# Altium schematic sheet 04_Zynq_Power.SchDoc
size A2; SheetNumber: 5; SheetTotal: 7
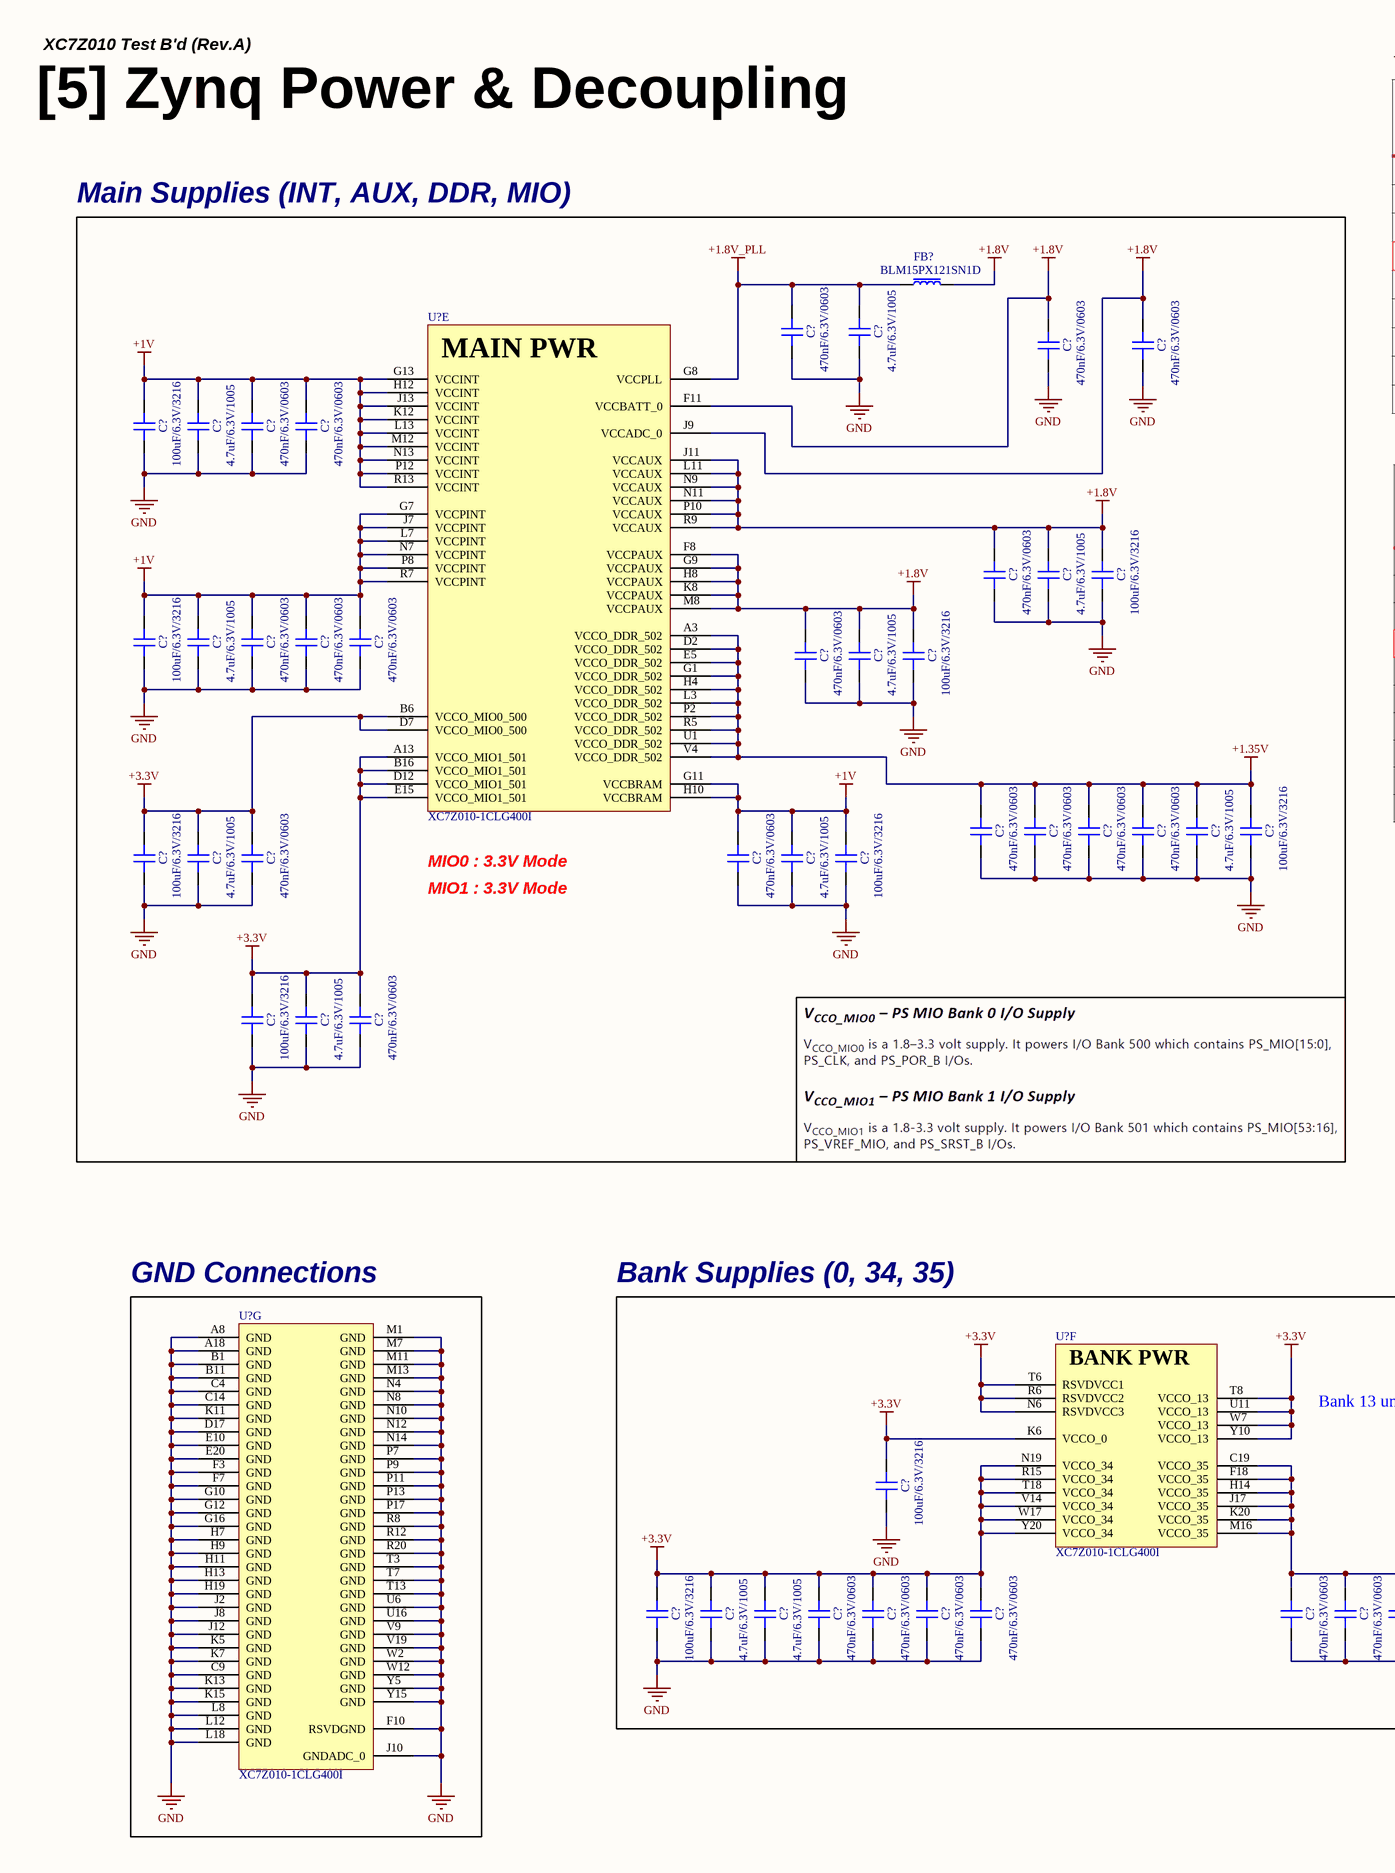
[diagram p0: 04_Zynq_Power.SchDoc, left]
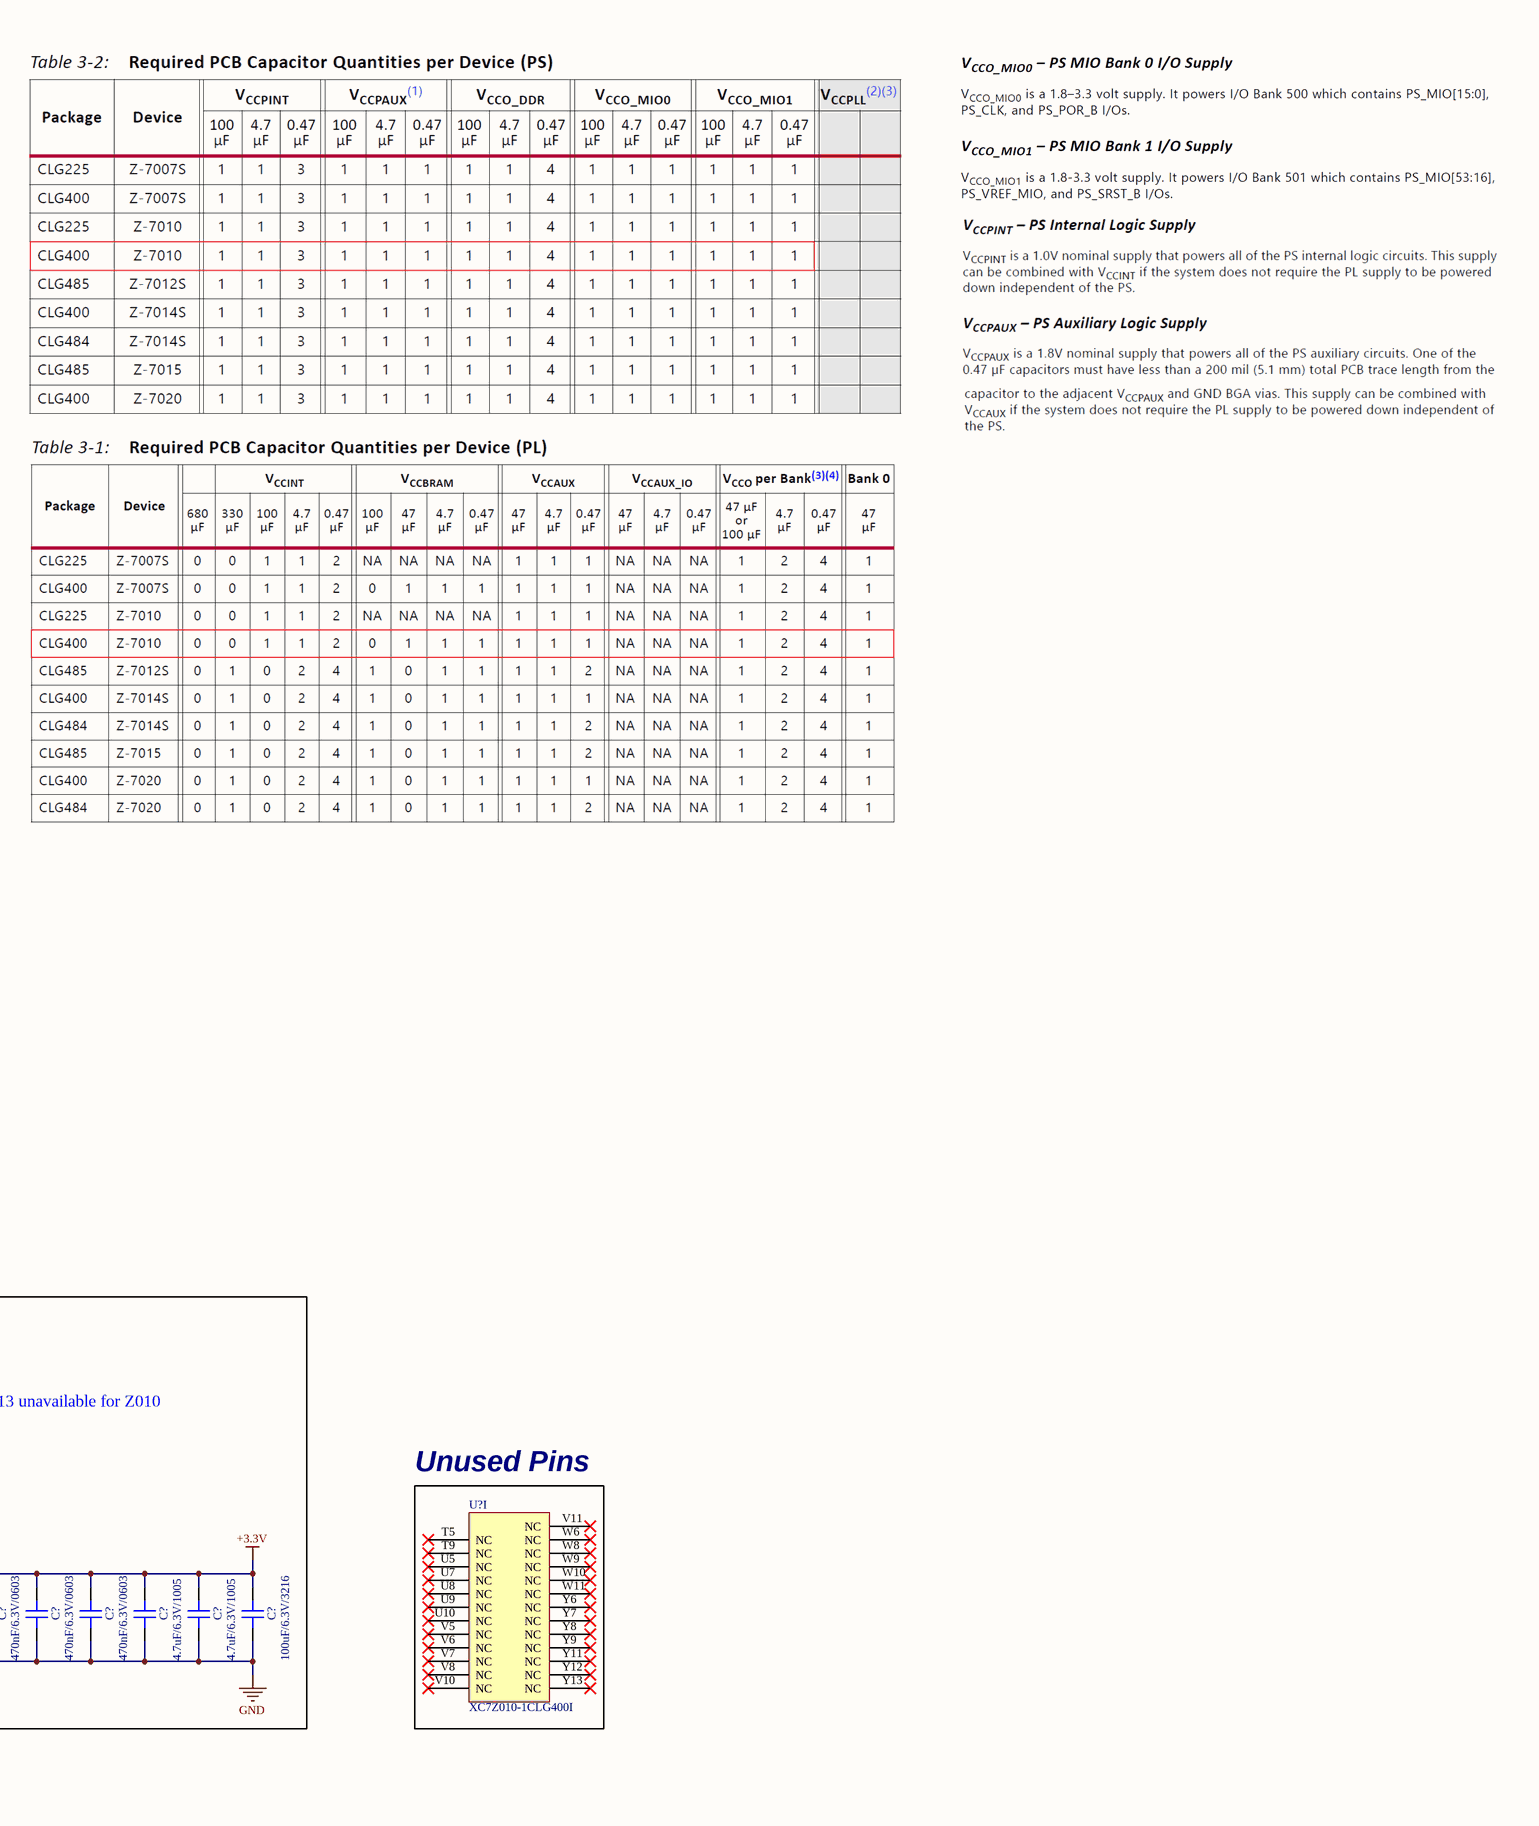
[diagram p1: 04_Zynq_Power.SchDoc, right]

## Parts
(Parts that share a designator on the sheet are numbered #1, #2 ... from top to bottom, then left to right.)
C?#1  470nF/6.3V/0603  [CAP 0603 (0201_INCH)]
C?#2  4.7uF/6.3V/1005  [CAP 1005 (0402_INCH)]
C?#3  470nF/6.3V/0603  [CAP 0603 (0201_INCH)]
C?#4  470nF/6.3V/0603  [CAP 0603 (0201_INCH)]
C?#5  100uF/6.3V/3216  [CAP 3216 (1206_INCH) - H1.8MM]
C?#6  4.7uF/6.3V/1005  [CAP 1005 (0402_INCH)]
C?#7  470nF/6.3V/0603  [CAP 0603 (0201_INCH)]
C?#8  470nF/6.3V/0603  [CAP 0603 (0201_INCH)]
C?#9  470nF/6.3V/0603  [CAP 0603 (0201_INCH)]
C?#10  4.7uF/6.3V/1005  [CAP 1005 (0402_INCH)]
C?#11  100uF/6.3V/3216  [CAP 3216 (1206_INCH) - H1.8MM]
C?#12  100uF/6.3V/3216  [CAP 3216 (1206_INCH) - H1.8MM]
C?#13  4.7uF/6.3V/1005  [CAP 1005 (0402_INCH)]
C?#14  470nF/6.3V/0603  [CAP 0603 (0201_INCH)]
C?#15  470nF/6.3V/0603  [CAP 0603 (0201_INCH)]
C?#16  470nF/6.3V/0603  [CAP 0603 (0201_INCH)]
C?#17  470nF/6.3V/0603  [CAP 0603 (0201_INCH)]
C?#18  4.7uF/6.3V/1005  [CAP 1005 (0402_INCH)]
C?#19  100uF/6.3V/3216  [CAP 3216 (1206_INCH) - H1.8MM]
C?#20  470nF/6.3V/0603  [CAP 0603 (0201_INCH)]
C?#21  470nF/6.3V/0603  [CAP 0603 (0201_INCH)]
C?#22  470nF/6.3V/0603  [CAP 0603 (0201_INCH)]
C?#23  470nF/6.3V/0603  [CAP 0603 (0201_INCH)]
C?#24  4.7uF/6.3V/1005  [CAP 1005 (0402_INCH)]
C?#25  100uF/6.3V/3216  [CAP 3216 (1206_INCH) - H1.8MM]
C?#26  100uF/6.3V/3216  [CAP 3216 (1206_INCH) - H1.8MM]
C?#27  4.7uF/6.3V/1005  [CAP 1005 (0402_INCH)]
C?#28  470nF/6.3V/0603  [CAP 0603 (0201_INCH)]
C?#29  470nF/6.3V/0603  [CAP 0603 (0201_INCH)]
C?#30  4.7uF/6.3V/1005  [CAP 1005 (0402_INCH)]
C?#31  100uF/6.3V/3216  [CAP 3216 (1206_INCH) - H1.8MM]
C?#32  100uF/6.3V/3216  [CAP 3216 (1206_INCH) - H1.8MM]
C?#33  4.7uF/6.3V/1005  [CAP 1005 (0402_INCH)]
C?#34  470nF/6.3V/0603  [CAP 0603 (0201_INCH)]
C?#35  100uF/6.3V/3216  [CAP 3216 (1206_INCH) - H1.8MM]
C?#36  100uF/6.3V/3216  [CAP 3216 (1206_INCH) - H1.8MM]
C?#37  4.7uF/6.3V/1005  [CAP 1005 (0402_INCH)]
C?#38  4.7uF/6.3V/1005  [CAP 1005 (0402_INCH)]
C?#39  470nF/6.3V/0603  [CAP 0603 (0201_INCH)]
C?#40  470nF/6.3V/0603  [CAP 0603 (0201_INCH)]
C?#41  470nF/6.3V/0603  [CAP 0603 (0201_INCH)]
C?#42  470nF/6.3V/0603  [CAP 0603 (0201_INCH)]
C?#43  470nF/6.3V/0603  [CAP 0603 (0201_INCH)]
C?#44  470nF/6.3V/0603  [CAP 0603 (0201_INCH)]
C?#45  470nF/6.3V/0603  [CAP 0603 (0201_INCH)]
C?#46  470nF/6.3V/0603  [CAP 0603 (0201_INCH)]
C?#47  4.7uF/6.3V/1005  [CAP 1005 (0402_INCH)]
C?#48  4.7uF/6.3V/1005  [CAP 1005 (0402_INCH)]
C?#49  100uF/6.3V/3216  [CAP 3216 (1206_INCH) - H1.8MM]
FB?  BLM15PX121SN1D  [FB 1005 (0402_inch)]
U?#1  XC7Z010-1CLG400I  (part E of 9)
U?#2  XC7Z010-1CLG400I  (part G of 9)
U?#3  XC7Z010-1CLG400I  (part F of 9)
U?#4  XC7Z010-1CLG400I  (part I of 9)

## Blocks framed on the sheet
Main Supplies (INT, AUX, DDR, MIO): C?#1-C?#34 FB? U?#1
GND Connections: U?#2
Bank Supplies (0, 34, 35): C?#35-C?#49 U?#3
Unused Pins: U?#4

## Nets
+1.8V: C?#3.2 C?#4.2 C?#9.2 C?#10.2 C?#11.2 C?#17.2 C?#18.2 C?#19.2 FB?.2 U?#1.F8(VCCPAUX) U?#1.F11(VCCBATT_0) U?#1.G9(VCCPAUX) U?#1.H8(VCCPAUX) U?#1.J9(VCCADC_0) U?#1.J11(VCCAUX) U?#1.K8(VCCPAUX) U?#1.L11(VCCAUX) U?#1.M8(VCCPAUX) U?#1.N9(VCCAUX) U?#1.N11(VCCAUX) U?#1.P10(VCCAUX) U?#1.R9(VCCAUX)
+1.8V_PLL: C?#1.2 C?#2.2 FB?.1 U?#1.G8(VCCPLL)
+1.35V: C?#20.2 C?#21.2 C?#22.2 C?#23.2 C?#24.2 C?#25.2 U?#1.A3(VCCO_DDR_502) U?#1.D2(VCCO_DDR_502) U?#1.E5(VCCO_DDR_502) U?#1.G1(VCCO_DDR_502) U?#1.H4(VCCO_DDR_502) U?#1.L3(VCCO_DDR_502) U?#1.P2(VCCO_DDR_502) U?#1.R5(VCCO_DDR_502) U?#1.U1(VCCO_DDR_502) U?#1.V4(VCCO_DDR_502)
+1V: C?#5.2 C?#6.2 C?#7.2 C?#8.2 C?#12.2 C?#13.2 C?#14.2 C?#15.2 C?#16.2 C?#29.2 C?#30.2 C?#31.2 U?#1.G7(VCCPINT) U?#1.G11(VCCBRAM) U?#1.G13(VCCINT) U?#1.H10(VCCBRAM) U?#1.H12(VCCINT) U?#1.J7(VCCPINT) U?#1.J13(VCCINT) U?#1.K12(VCCINT) U?#1.L7(VCCPINT) U?#1.L13(VCCINT) U?#1.M12(VCCINT) U?#1.N7(VCCPINT) U?#1.N13(VCCINT) U?#1.P8(VCCPINT) U?#1.P12(VCCINT) U?#1.R7(VCCPINT) U?#1.R13(VCCINT)
+3.3V: C?#26.2 C?#27.2 C?#28.2 C?#32.2 C?#33.2 C?#34.2 C?#35.2 C?#36.2 C?#37.2 C?#38.2 C?#39.2 C?#40.2 C?#41.2 C?#42.2 C?#43.2 C?#44.2 C?#45.2 C?#46.2 C?#47.2 C?#48.2 C?#49.2 U?#1.A13(VCCO_MIO1_501) U?#1.B6(VCCO_MIO0_500) U?#1.B16(VCCO_MIO1_501) U?#1.D7(VCCO_MIO0_500) U?#1.D12(VCCO_MIO1_501) U?#1.E15(VCCO_MIO1_501) U?#3.C19(VCCO_35) U?#3.F18(VCCO_35) U?#3.H14(VCCO_35) U?#3.J17(VCCO_35) U?#3.K6(VCCO_0) U?#3.K20(VCCO_35) U?#3.M16(VCCO_35) U?#3.N6(RSVDVCC3) U?#3.N19(VCCO_34) U?#3.R6(RSVDVCC2) U?#3.R15(VCCO_34) U?#3.T6(RSVDVCC1) U?#3.T8(VCCO_13) U?#3.T18(VCCO_34) U?#3.U11(VCCO_13) U?#3.V14(VCCO_34) U?#3.W7(VCCO_13) U?#3.W17(VCCO_34) U?#3.Y10(VCCO_13) U?#3.Y20(VCCO_34)
GND: C?#1.1 C?#2.1 C?#3.1 C?#4.1 C?#5.1 C?#6.1 C?#7.1 C?#8.1 C?#9.1 C?#10.1 C?#11.1 C?#12.1 C?#13.1 C?#14.1 C?#15.1 C?#16.1 C?#17.1 C?#18.1 C?#19.1 C?#20.1 C?#21.1 C?#22.1 C?#23.1 C?#24.1 C?#25.1 C?#26.1 C?#27.1 C?#28.1 C?#29.1 C?#30.1 C?#31.1 C?#32.1 C?#33.1 C?#34.1 C?#35.1 C?#36.1 C?#37.1 C?#38.1 C?#39.1 C?#40.1 C?#41.1 C?#42.1 C?#43.1 C?#44.1 C?#45.1 C?#46.1 C?#47.1 C?#48.1 C?#49.1 U?#2.A8(GND) U?#2.A18(GND) U?#2.B1(GND) U?#2.B11(GND) U?#2.C4(GND) U?#2.C9(GND) U?#2.C14(GND) U?#2.D17(GND) U?#2.E10(GND) U?#2.E20(GND) U?#2.F3(GND) U?#2.F7(GND) U?#2.F10(RSVDGND) U?#2.G10(GND) U?#2.G12(GND) U?#2.G16(GND) U?#2.H7(GND) U?#2.H9(GND) U?#2.H11(GND) U?#2.H13(GND) U?#2.H19(GND) U?#2.J2(GND) U?#2.J8(GND) U?#2.J10(GNDADC_0) U?#2.J12(GND) U?#2.K5(GND) U?#2.K7(GND) U?#2.K11(GND) U?#2.K13(GND) U?#2.K15(GND) U?#2.L8(GND) U?#2.L12(GND) U?#2.L18(GND) U?#2.M1(GND) U?#2.M7(GND) U?#2.M11(GND) U?#2.M13(GND) U?#2.N4(GND) U?#2.N8(GND) U?#2.N10(GND) U?#2.N12(GND) U?#2.N14(GND) U?#2.P7(GND) U?#2.P9(GND) U?#2.P11(GND) U?#2.P13(GND) U?#2.P17(GND) U?#2.R8(GND) U?#2.R12(GND) U?#2.R20(GND) U?#2.T3(GND) U?#2.T7(GND) U?#2.T13(GND) U?#2.U6(GND) U?#2.U16(GND) U?#2.V9(GND) U?#2.V19(GND) U?#2.W2(GND) U?#2.W12(GND) U?#2.Y5(GND) U?#2.Y15(GND)

Not connected (* = marked no-connect by the designer): U?#4 T5(NC)* T9(NC)* U5(NC)* U7(NC)* U8(NC)* U9(NC)* U10(NC)* V5(NC)* V6(NC)* V7(NC)* V8(NC)* V10(NC)* V11(NC)* W6(NC)* W8(NC)* W9(NC)* W10(NC)* W11(NC)* Y6(NC)* Y7(NC)* Y8(NC)* Y9(NC)* Y11(NC)* Y12(NC)* Y13(NC)*

## Notes on the sheet
- XC7Z010 Test B'd (Rev.A)
- [5] Zynq Power & Decoupling
- MIO0 : 3.3V Mode
- MIO1 : 3.3V Mode
- Bank 13 unavailable for Z010
- Title
- Rev
- Doc
- Sheet #
- of
- Author
- This document is copyright of ArkX and shall not be revealed, produced, copied, in whole or in part,
- Date
- nor used for any purpose other than submitted.
- (in symbol IC_SOC_XC7Z010-1CLG400I, part E) MAIN PWR
- (in symbol IC_SOC_XC7Z010-1CLG400I, part F) BANK PWR

## Library data of the parts
C?#1 C?#3 C?#4 C?#7-C?#9 C?#14-C?#17 C?#20-C?#23 C?#28 C?#29 C?#34 C?#39-C?#46 = CAP_470nF/6.3V/0603: Ceramic CAP_470nF/6.3V/0603; LCSC Part #: C2992535; JLCPCB Part Type: Extended Part
C?#2 C?#6 C?#10 C?#13 C?#18 C?#24 C?#27 C?#30 C?#33 C?#37 C?#38 C?#47 C?#48 = CAP_4.7uF/6.3V/1005: Ceramic CAP_4.7uF/6.3V/1005; LCSC Part #: C76995; JLCPCB Part Type: Extended Part
C?#5 C?#11 C?#12 C?#19 C?#25 C?#26 C?#31 C?#32 C?#35 C?#36 C?#49 = CAP_100uF/6.3V/3216: Ceramic CAP_100uF/6.3V/3216; LCSC Part #: C15008; JLCPCB Part Type: Basic Part
FB? = FB_BLM15PX121SN1D: 55mΩ ±25% 120Ω@100MHz 0402  Ferrite Beads ROHS; LCSC Part #: C88970; JLCPCB Part Type: Extended Part
U?#1-U?#4 = IC_SOC_XC7Z010-1CLG400I: Dual ARM® Cortex®-A9 MPCore™ with CoreSight™ System On Chip (SOC) IC Zynq®-7000 Artix™-7 FPGA, 28K Logic Cells 766MHz 400-CSPBGA (17x17)